# EAGLE design PCU_R0 (EAGLE 7.7.0)
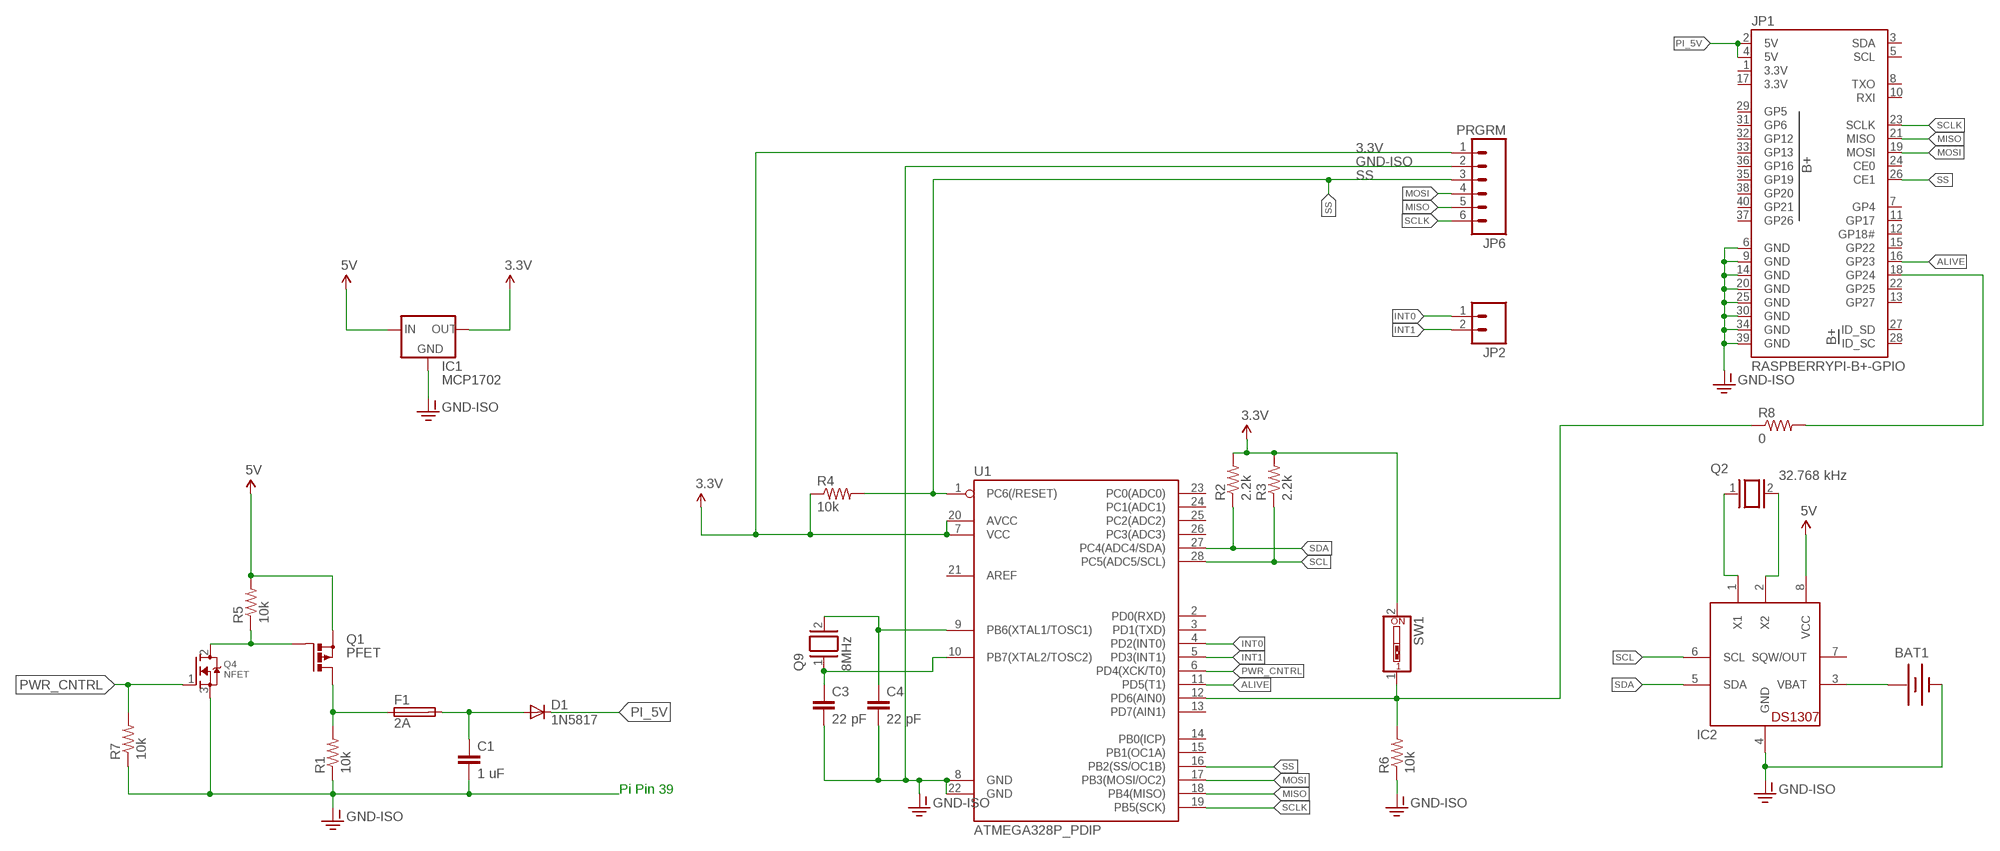
[diagram p0: schematic, sheet 1]

## Parts
BAT1  BATTERY12MM  [BATTCON_12MM]
C1  1 uF  C2,5-3  [C2.5-3]
C3  22 pF  C2,5-3  [C2.5-3]
C4  22 pF  C2,5-3  [C2.5-3]
D1  1N5817  1N4004  [DO41-10]
F1  2A  FUSEPICOFUSE  [PICOFUSE]
IC1  MCP1702  MCP1700TRI  [TO92]
IC2  DS1307  [DIL08]
JP1  RASPBERRYPI-B+-GPIO  [2X20-SHROUDED]
JP2  M02PTH  [1X02]
JP6  PRGRM  M06SILK_FEMALE_PTH  [1X06]
Q1  PFET  PMOSFET_PTO220BV  [TO220BV]
Q2  32.768 kHz  XTAL/S  [QS]
Q4  NFET  MOSFET-NGDS_TO220V  [TO220V]
Q9  8MHz  XTAL/S  [QS]
R1  10k  RESISTOR1206  [1206]
R2  2.2k  RESISTOR1206  [1206]
R3  2.2k  RESISTOR1206  [1206]
R4  10k  RESISTOR1206  [1206]
R5  10k  RESISTOR1206  [1206]
R6  10k  RESISTOR1206  [1206]
R7  10k  RESISTOR1206  [1206]
R8  0  RESISTOR1206  [1206]
SW1  SW_DIP-1  [EDG-01]
U1  ATMEGA328P_PDIP  [DIL28-3]

## Nets
3.3V: IC1.3(OUT) JP6.1 R2.2 R3.2 R4.1 SW1.2 U1.7(VCC) U1.20(AVCC)
5V: IC1.2(IN) IC2.8(VCC) Q1.S R5.2
ALIVE: JP1.16(GP23) U1.11(PD5(T1))
GND-ISO [actuator]: BAT1.GND(-) C1.2 C3.2 C4.2 IC1.1(GND) IC2.4(GND) JP1.6(GND) JP1.9(GND) JP1.14(GND) JP1.20(GND) JP1.25(GND) JP1.30(GND) JP1.34(GND) JP1.39(GND) JP6.2 Q4.3(S) R1.1 R6.1 R7.1 U1.8(GND) U1.22(GND)
INT0: JP2.1 U1.4(PD2(INT0))
INT1: JP2.2 U1.5(PD3(INT1))
MISO: JP1.21(MISO) JP6.5 U1.18(PB4(MISO))
MOSI: JP1.19(MOSI) JP6.4 U1.17(PB3(MOSI/OC2))
N$1: F1.1 Q1.D R1.2
N$2: C1.1 D1.A F1.2
N$3: IC2.1(X1) Q2.1
N$4: IC2.2(X2) Q2.2
N$5: BAT1.PWR@1(+) IC2.3(VBAT)
N$6: Q1.G Q4.2(D) R5.1
N$7 [actuator]: JP1.18(GP24) R8.2
N$8 [actuator]: R6.2 R8.1 SW1.1 U1.12(PD6(AIN0))
N$11: C3.1 Q9.1 U1.10(PB7(XTAL2/TOSC2))
N$20: C4.1 Q9.2 U1.9(PB6(XTAL1/TOSC1))
PI_5V: D1.C JP1.2(5V) JP1.4(5V)
PWR_CNTRL: Q4.1(G) R7.2 U1.6(PD4(XCK/T0))
SCL: IC2.6(SCL) R3.1 U1.28(PC5(ADC5/SCL))
SCLK: JP1.23(SCLK) JP6.6 U1.19(PB5(SCK))
SDA: IC2.5(SDA) R2.1 U1.27(PC4(ADC4/SDA))
SS: JP1.26(CE1) JP6.3 R4.2 U1.1(PC6(/RESET)) U1.16(PB2(SS/OC1B))
Unconnected: IC2.7(SQW/OUT) JP1.3(SDA) JP1.5(SCL) JP1.7(GP4) JP1.8(TXO) JP1.10(RXI) JP1.11(GP17) JP1.12(GP18#) JP1.13(GP27) JP1.15(GP22) JP1.22(GP25) JP1.24(CE0) JP1.27(ID_SD) JP1.28(ID_SC) JP1.29(GP5) JP1.31(GP6) JP1.32(GP12) JP1.33(GP13) JP1.35(GP19) JP1.36(GP16) JP1.37(GP26) JP1.38(GP20) JP1.40(GP21) U1.2(PD0(RXD)) U1.3(PD1(TXD)) U1.13(PD7(AIN1)) U1.14(PB0(ICP)) U1.15(PB1(OC1A)) U1.21(AREF) U1.23(PC0(ADC0)) U1.24(PC1(ADC1)) U1.25(PC2(ADC2)) U1.26(PC3(ADC3))

## Notes on the sheet
- Pi Pin 39

## Power pins joined to a net without a drawn wire
3.3V: JP1.1(3.3V) JP1.17(3.3V)

## Library data of the parts
BAT1 = SparkFun-Electromechanical:BATTERY: Battery Holders Various common sizes : AA, AAA, 18650 (PRT-12895), 20mm coin cell and 12mm coin cell. 20MM_4LEGS, BATT-10373; PROD_ID: BATT-08044
C1 C3 C4 = capacitor-wima:C: CAPACITOR naming: grid - package width
D1 = adafruit:1N4004: DIODE General purpose 1N400x type rectifier (With bigger pads) http://www.ladyada.net/library/pcb/eaglelibrary.html
F1 = fuse:FUSE: Fuse; OC_FARNELL: unknown; OC_NEWARK: unknown
IC1 = adafruit:MCP1700: VOLTAGE REGULATOR
IC2 = adafruit:DS1307: DS1307 Real time clock (RTC) with battery backup ability. Talk to it via i2c
JP1 = SparkFun-Boards:RASPBERRYPI-B+-GPIO: Raspberry Pi B+ GPIO Header 2x20 pin connector
JP2 = SparkFun-Connectors:M02: Standard 2-pin 0.1" header. Use with - straight break away headers ( PRT-00116) - right angle break away headers (PRT-00553) - swiss pins (PRT-00743) - machine pins (PRT-00117) - female headers (PRT-00115) Molex polarized connector foot print use with: PRT-08233 with associated crimp pins and housings. 2.54_SCREWTERM for use with PRT-10571. 3.5mm Screw Terminal footprints for PRT-08084 5mm Screw Terminal footprints for use with PRT-08432
JP6 = SparkFun-Connectors:M06: Header 6 Standard 6-pin 0.1" header. Use with straight break away headers (SKU : PRT-00116), right angle break away headers (PRT-00553), swiss pins (PRT-00743), machine pins (PRT-00117), and female headers (PRT-00115). Molex polarized connector foot print use with SKU : PRT-08094 with associated crimp pins and housings. NOTES ON THE VARIANTS LOCK and LOCK_LONGPADS... This footprint was designed to help hold the alignment of a through-hole component (i.e. 6-pin header) while soldering it into place. You may notice that each hole has been shifted either up or down by 0.005 of an inch from it's more standard position (which is a perfectly straight line). This slight alteration caused the pins (the squares in the middle) to touch the edges of the holes. Because they are alternating, it causes a "brace" to hold the component in place. 0.005 has proven to be the perfect amount of "off-center" position when using our standard breakaway headers. Although looks a little odd when you look at the bare footprint, once you have a header in there, the alteration is very hard to notice. Also,if you push a header all the way into place, it is covered up entirely on the bottom side. This idea of altering the position of holes to aid alignment will be further integrated into the Sparkfun Library for other footprints. It can help hold any component with 3 or more connection pins.; PROD_ID: CONN-08437
Q1 = transistor-power:PMOSFET_P: Power MOSFET P-Channel
Q2 Q9 = special:XTAL/S: CRYSTAL
Q4 = adafruit:MOSFET-N: N-Channel Mosfet 2N7002E - 60V 260mA SOT23 [Digikey: 2N7002ET1GOSTR-ND] - REEL BSH103 - 30V 850mA SOT23 [Digikey: 568-5013-1-ND]
R1-R8 = SparkFun-Passives:RESISTOR: Resistor Basic schematic elements and footprints for 0603, 1206, and PTH resistors.
SW1 = special:SW_DIP-1: DIP SWITCH
U1 = SparkFun-DigitalIC:ATMEGA328P_PDIP: uC used in the Arduino 32kb flash, 1k EEPROM, 2k SRAM This is the through-hole version of this chip.

## Net classes
1 actuator: width 0.813 mm, clearance 0.229 mm
2 motor: width 0.406 mm, clearance 0.229 mm
3 supply: width 0.406 mm, clearance 0.229 mm

## Board
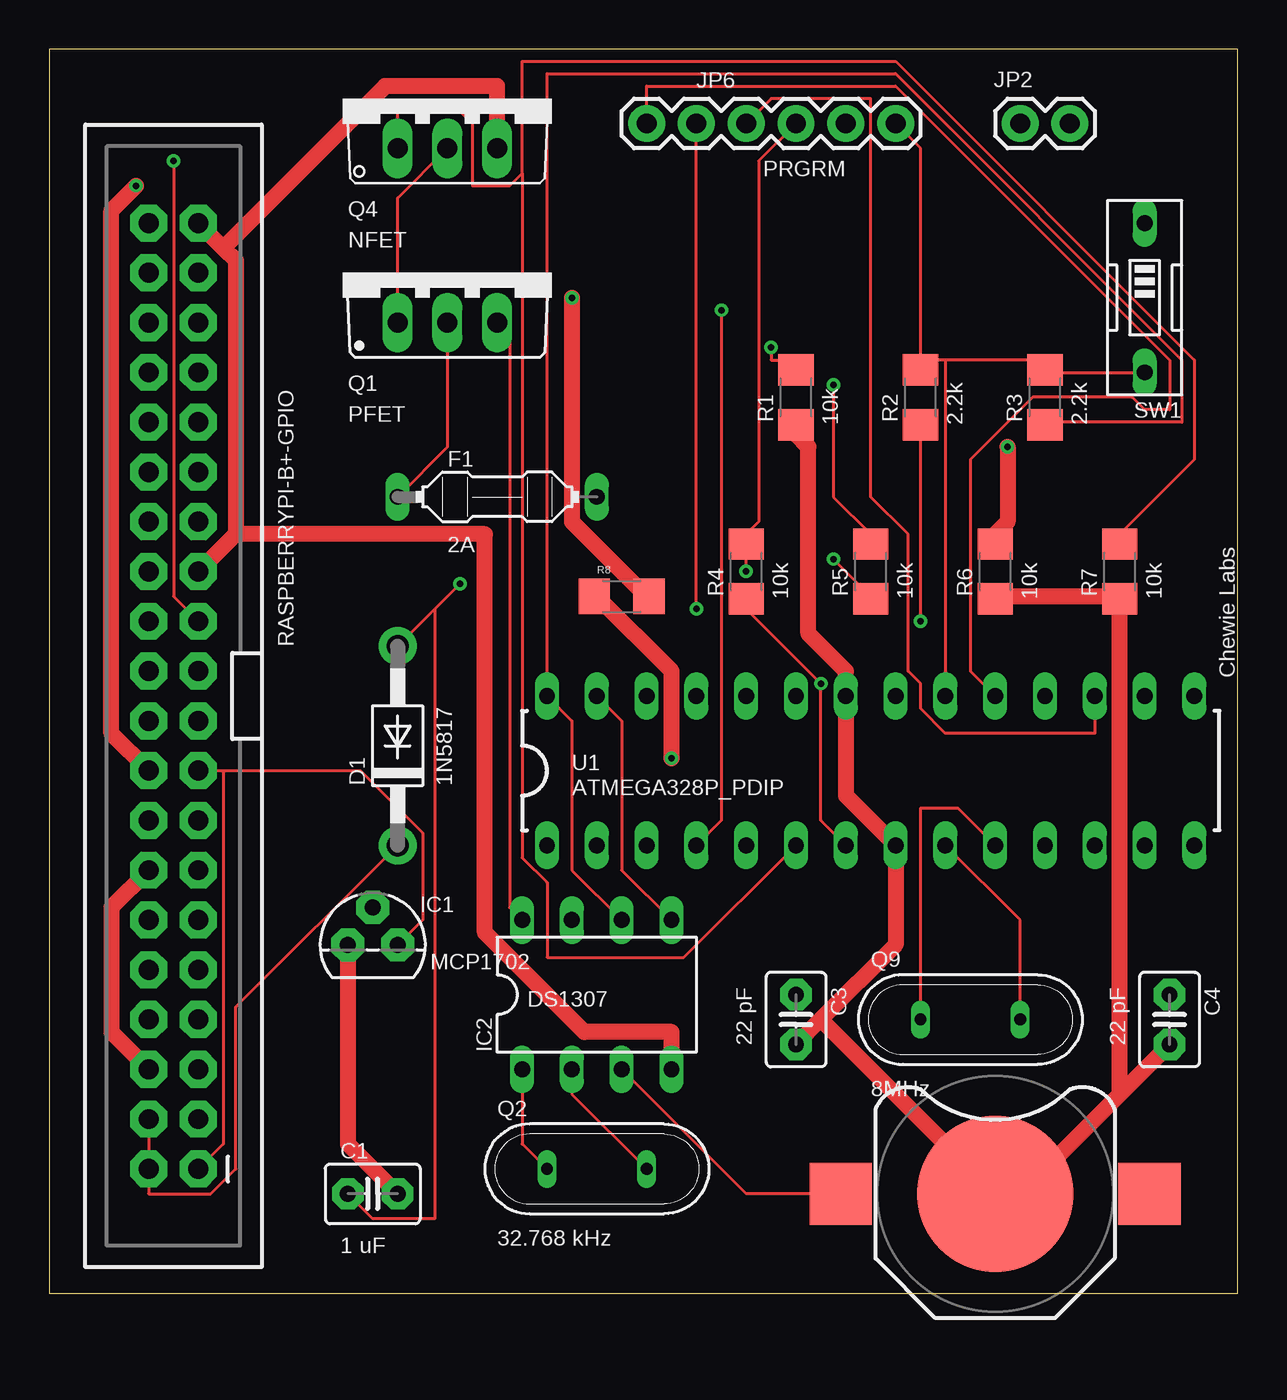
[diagram p1: board, top side]
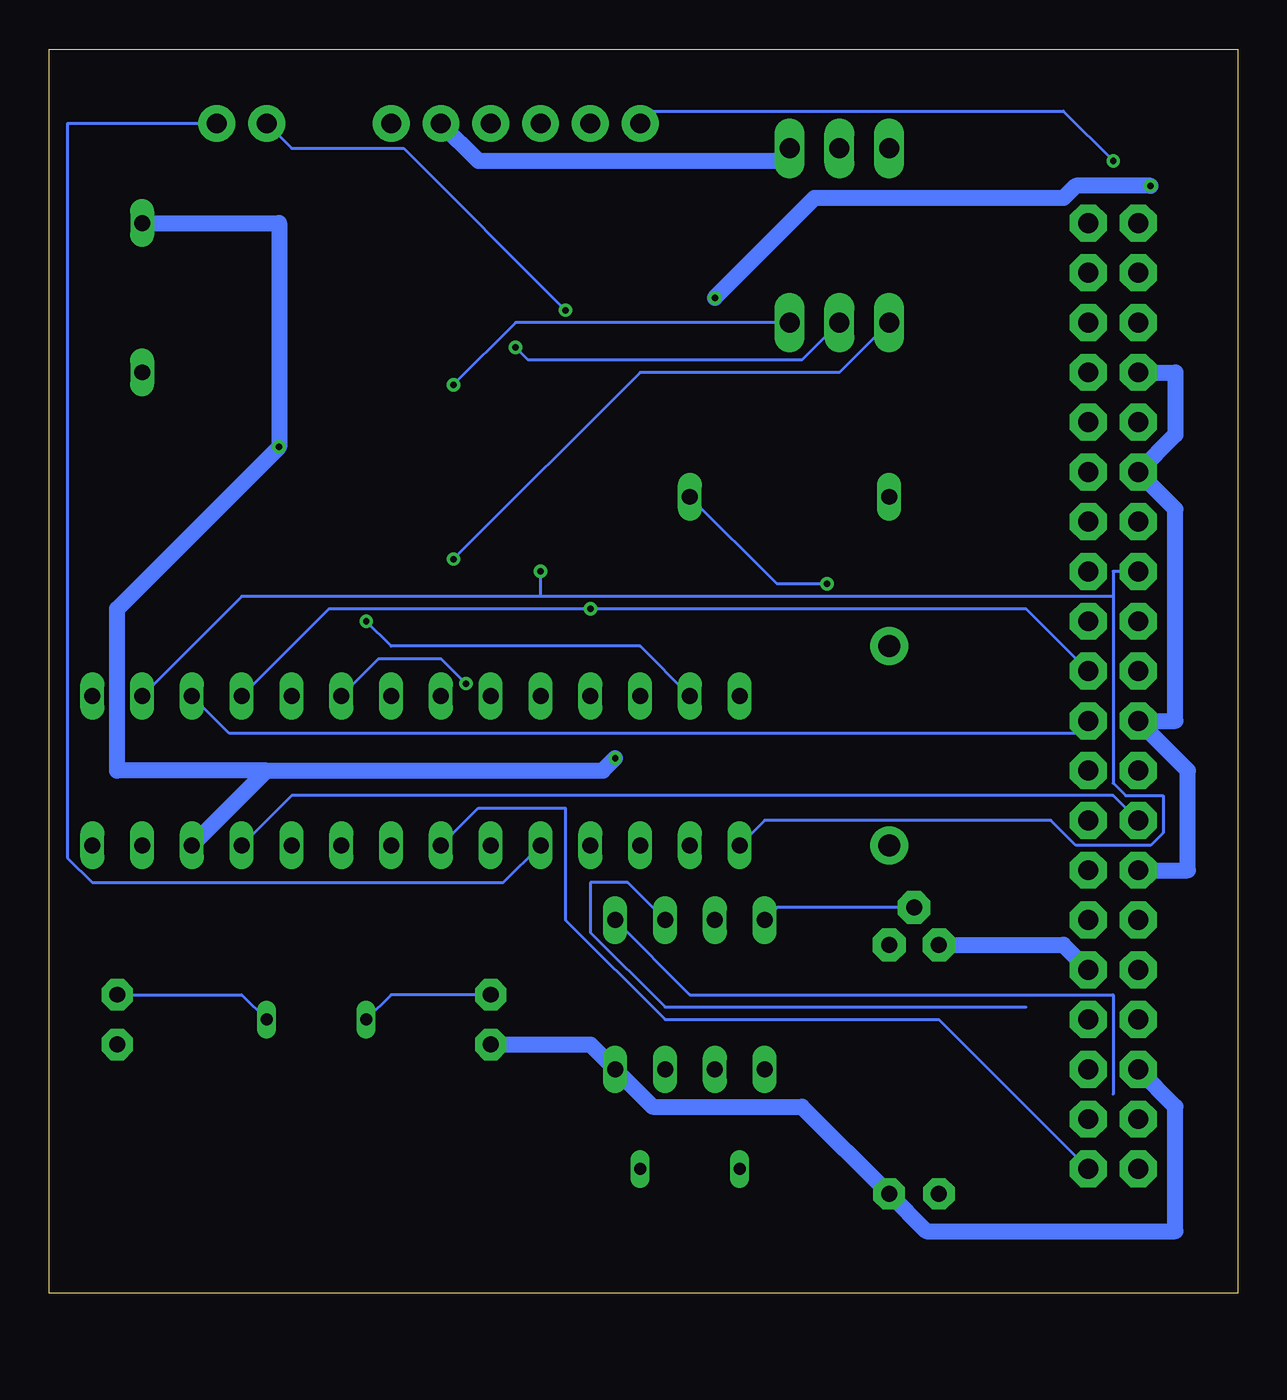
[diagram p2: board, bottom side, seen from below]

Size 60.63 x 63.49 mm. Coordinates in mm from the lower left corner, seen from the top.
Outline: 0,0 60.63,0 60.63,63.49 0,63.49 0,0
Copper layers (1*16): Top 0.0356mm / dielectric 1.5011mm / Bottom 0.0356mm
Design rules "LaenPCBOrder": minimum track width 6mil, minimum drill 13mil, track to track 6mil, track to pad 6mil, pad to pad 6mil, via to via 6mil, smd to smd 6mil, copper to edge 15mil, drill to drill 6mil, minimum pad ring 7mil, minimum via ring 7mil, stop-mask expansion 3mil, vias tented up to drill 0mil, thermal gap 10mil

### Footprints (pad centres in the part's own frame; a part is rotated, then mirrored left to right if it is on the bottom)
BATTCON_12MM = smd 8 x 8: GND 0,0 | smd 3.175 x 3.175: PWR@1 -7.874,0; PWR@2 7.874,0
C2.5-3 = drill 0.813 pad 1.6 octagon: 1 -1.27,0; 2 1.27,0
DO41-10 = drill 1.118 pad 1.93: A 5.08,0; C -5.08,0
PICOFUSE = drill 0.813 long: 1 -5.08,0; 2 5.08,0
TO92 = drill 0.813 pad 1.676 octagon: 1 -1.27,0; 2 0,1.905; 3 1.27,0
DIL08 = drill 0.813 long: 1 -3.81,-3.81; 2 -1.27,-3.81; 3 1.27,-3.81; 4 3.81,-3.81; 5 3.81,3.81; 6 1.27,3.81; 7 -1.27,3.81; 8 -3.81,3.81
2X20-SHROUDED = drill 1.016 pad 1.88 octagon: 1 -1.27,24.13; 2 1.27,24.13; 3 -1.27,21.59; 4 1.27,21.59; 5 -1.27,19.05; 6 1.27,19.05; 7 -1.27,16.51; 8 1.27,16.51; 9 -1.27,13.97; 10 1.27,13.97; 11 -1.27,11.43; 12 1.27,11.43; 13 -1.27,8.89; 14 1.27,8.89; 15 -1.27,6.35; 16 1.27,6.35; 17 -1.27,3.81; 18 1.27,3.81; 19 -1.27,1.27; 20 1.27,1.27; 21 -1.27,-1.27; 22 1.27,-1.27; 23 -1.27,-3.81; 24 1.27,-3.81; 25 -1.27,-6.35; 26 1.27,-6.35; 27 -1.27,-8.89; 28 1.27,-8.89; 29 -1.27,-11.43; 30 1.27,-11.43; 31 -1.27,-13.97; 32 1.27,-13.97; 33 -1.27,-16.51; 34 1.27,-16.51; 35 -1.27,-19.05; 36 1.27,-19.05; 37 -1.27,-21.59; 38 1.27,-21.59; 39 -1.27,-24.13; 40 1.27,-24.13
1X02 = drill 1.016 pad 1.88: 1 0,0; 2 2.54,0
1X06 = drill 1.016 pad 1.88: 1 0,0; 2 2.54,0; 3 5.08,0; 4 7.62,0; 5 10.16,0; 6 12.7,0
TO220BV = drill 1.016 long: D 0,-2.54; G -2.54,-2.54; S 2.54,-2.54
QS = drill 0.61 long: 1 -2.54,0; 2 2.54,0
TO220V = drill 1.016 long: 1 -2.54,-2.54; 2 0,-2.54; 3 2.54,-2.54
1206 = smd 1.6 x 1.8: 1 -1.4,0; 2 1.4,0
EDG-01 = drill 0.813 long: 1 0,-3.81; 2 0,3.81
DIL28-3 = drill 0.813 long: 1 -16.51,-3.81; 2 -13.97,-3.81; 3 -11.43,-3.81; 4 -8.89,-3.81; 5 -6.35,-3.81; 6 -3.81,-3.81; 7 -1.27,-3.81; 8 1.27,-3.81; 9 3.81,-3.81; 10 6.35,-3.81; 11 8.89,-3.81; 12 11.43,-3.81; 13 13.97,-3.81; 14 16.51,-3.81; 15 16.51,3.81; 16 13.97,3.81; 17 11.43,3.81; 18 8.89,3.81; 19 6.35,3.81; 20 3.81,3.81; 21 1.27,3.81; 22 -1.27,3.81; 23 -3.81,3.81; 24 -6.35,3.81; 25 -8.89,3.81; 26 -11.43,3.81; 27 -13.97,3.81; 28 -16.51,3.81

### Placement (x,y rotation side)
BAT1  48.26,5.08 0 top
C1  16.51,5.08 0 top
C3  38.1,13.97 270 top
C4  57.15,13.97 270 top
D1  17.78,27.94 90 top
F1  22.86,40.64 0 top
IC1  16.51,17.78 0 top
IC2  27.94,15.24 0 top
JP1  6.35,30.48 180 top
JP2  49.53,59.69 0 top
JP6  43.18,59.69 180 top
Q1  20.32,52.07 0 top
Q2  27.94,6.35 0 top
Q4  20.32,60.96 0 top
Q9  46.99,13.97 0 top
R1  38.1,45.72 90 top
R2  44.45,45.72 90 top
R3  50.8,45.72 90 top
R4  35.56,36.83 90 top
R5  41.91,36.83 90 top
R6  48.26,36.83 90 top
R7  54.61,36.83 90 top
R8  29.21,35.56 0 top
SW1  55.88,50.8 180 top
U1  41.91,26.67 0 top

### Tracks (layer width: path | path; a pad name or v marks a point on that pad's centre or on a via)
3.3V  (via drill 0.33)
  Top 0.152: IC1.3 19.05,19.05 19.05,23.5 15.88,26.67 8.89,26.67 | JP1.17 8.89,26.67 | JP1.1 8.89,7.62 8.89,26.67 | U1.7 39.37,24.13 v39.37,31.11 35.56,34.93 R4.1 | 45.72,47.62 50.8,47.62 R3.2 50.8,46.99 SW1.2 | 45.72,47.62 44.45,47.62 | 45.72,47.62 U1.20 | JP6.1 44.45,58.42 44.45,47.62 | 44.45,47.62 R2.2
  Bottom 0.152: v39.37,31.11 40.64,32.38 43.81,32.38 U1.20 | JP1.1 15.24,13.97 29.21,13.97 34.29,19.05 34.29,24.77 38.73,24.77 U1.7
5V  (via drill 0.33)
  Top 0.152: v40,46.36 40,40.64 41.91,38.74 R5.2 | IC2.8 23.5,19.68 23.5,48.9 Q1.S
  Bottom 0.152: IC2.8 23.5,19.68 IC1.2 | v40,46.36 36.83,49.53 Q1.S
ALIVE
  Bottom 0.152: U1.11 48.26,25.4 6.35,25.4 JP1.16
GND-ISO
  Top 0.813: 9.52,38.74 JP1.25 | 9.52,38.74 9.52,52.71 8.89,53.34 | JP1.39 8.89,53.34 | 8.89,53.34 17.14,61.6 22.86,61.6 Q4.3 | R6.1 48.26,35.56 54.61,35.56 R7.1 54.61,10.16 | 54.61,10.16 49.53,5.08 BAT1.GND 39.37,13.97 | 54.61,10.16 C4.2 | JP1.6 3.18,13.33 3.18,19.68 JP1.14 | C1.2 15.24,7.62 IC1.1 | R1.1 38.1,43.82 38.73,43.18 38.73,33.66 40.64,31.75 U1.22 40.64,25.4 U1.8 43.18,17.78 39.37,13.97 | 39.37,13.97 C3.2 | 9.52,38.74 22.22,38.74 22.22,18.41 27.31,13.33 31.75,13.33 IC2.4
  Bottom 0.813: Q4.3 23.5,57.79 38.73,57.79 JP6.2 | JP1.34 3.18,46.99 3.18,43.82 JP1.30 3.18,40.01 3.18,29.21 JP1.20 2.54,26.67 2.54,21.59 JP1.14 | JP1.9 8.89,17.78 IC1.1 | C3.2 33.02,12.7 IC2.4 29.85,9.53 22.22,9.53 C1.2 15.88,3.17 3.18,3.17 3.18,9.53 JP1.6
INT0  (via drill 0.33)
  Top 0.152: U1.4 34.29,24.13 v34.29,50.17
  Bottom 0.152: v34.29,50.17 42.55,58.42 48.26,58.42 JP2.1
INT1
  Bottom 0.152: U1.5 37.47,20.95 58.42,20.95 59.69,22.22 59.69,59.69 JP2.2
MISO  (via drill 0.33)
  Top 0.152: v33.02,34.93 JP6.5
  Bottom 0.152: U1.18 46.36,34.93 v33.02,34.93 10.79,34.93 JP1.21
MOSI
  Top 0.152: JP6.4 36.83,60.96 41.91,60.96 41.91,40.64 43.81,38.74 43.81,31.75 44.45,31.11 44.45,29.84 45.72,28.57 53.34,28.57 U1.17
  Bottom 0.152: U1.17 51.44,28.57 8.25,28.57 JP1.19
N$1  (via drill 0.33)
  Top 0.152: v36.83,48.26 36.83,47.62 38.1,47.62 R1.2 | F1.1 20.32,43.18 Q1.D
  Bottom 0.152: v36.83,48.26 36.19,47.62 22.22,47.62 Q1.D
N$2  (via drill 0.33)
  Top 0.152: D1.A 19.68,34.93 | 19.68,34.93 v20.95,36.2 | C1.1 16.51,3.81 19.68,3.81 19.68,34.93
  Bottom 0.152: F1.2 23.5,36.2 v20.95,36.2
N$3
  Top 0.152: Q2.1 24.13,7.62 IC2.1
N$4
  Top 0.152: Q2.2 26.67,10.16 IC2.2
N$5
  Top 0.152: IC2.3 35.56,5.08 BAT1.PWR@1
N$6  (via drill 0.33)
  Top 0.152: v40,37.47 41.91,35.56 R5.1 | Q4.2 17.78,55.88 Q1.G
  Bottom 0.152: v40,37.47 30.48,46.99 20.32,46.99 Q1.G
N$7  (via drill 0.33)
  Top 0.813: v26.67,50.8 26.67,39.37 30.48,35.56 R8.2 | v4.45,56.52 3.18,55.25 3.18,28.57 JP1.18
  Bottom 0.813: v26.67,50.8 21.59,55.88 8.89,55.88 8.25,56.52 v4.45,56.52
N$8  (via drill 0.33)
  Top 0.813: v48.89,43.18 48.89,39.37 48.26,38.74 R6.2 | v31.75,27.3 31.75,31.75 27.94,35.56 R8.1
  Bottom 0.813: SW1.1 48.89,54.61 v48.89,43.18 57.15,34.93 57.15,26.67 49.53,26.67 | v31.75,27.3 32.39,26.67 49.53,26.67 | U1.12 49.53,26.67
N$11
  Top 0.152: U1.10 46.36,24.77 44.45,24.77 Q9.1
  Bottom 0.152: Q9.1 43.18,15.24 C3.1
N$20
  Top 0.152: U1.9 49.53,19.05 Q9.2
  Bottom 0.152: Q9.2 50.8,15.24 C4.1
PI_5V
  Top 0.152: JP1.4 JP1.2 5.08,5.08 8.25,5.08 9.52,6.35 9.52,14.61 D1.C
PWR_CNTRL
  Top 0.152: 24.13,57.15 24.13,62.87 43.18,62.87 58.42,47.62 58.42,42.55 54.61,38.74 R7.2 | 24.13,57.15 23.5,56.52 21.59,56.52 21.59,59.69 20.95,60.33 17.78,60.33 Q4.1 | U1.6 32.39,17.14 25.4,17.14 25.4,20.95 24.13,22.22 24.13,57.15
SCL
  Top 0.152: R3.1 50.8,44.45 57.78,44.45 57.78,47.62 43.18,62.23 25.4,62.23 U1.28 26.67,29.21 26.67,21.59 IC2.6
  Bottom 0.152: 10.79,14.61 29.21,14.61 33.02,18.41 33.02,20.95 31.11,20.95 IC2.6
SCLK  (via drill 0.33)
  Top 0.152: U1.19 46.99,31.75 46.99,42.55 50.17,45.72 55.25,45.72 55.88,45.09 57.15,45.09 57.15,47.62 43.18,61.6 30.48,61.6 JP6.6 | JP1.23 6.35,35.56 v6.35,57.79
  Bottom 0.152: v6.35,57.79 8.89,60.33 29.85,60.33 JP6.6
SDA  (via drill 0.33)
  Top 0.152: v44.45,34.29 R2.1 | IC2.5 29.21,21.59 29.21,29.21 U1.27
  Bottom 0.152: v44.45,34.29 43.18,33.02 30.48,33.02 U1.27 | 6.35,10.16 6.35,15.24 27.94,15.24 IC2.5
SS  (via drill 0.33)
  Top 0.152: JP6.3 36.19,57.79 36.19,39.37 35.56,38.74 R4.2 v35.56,36.83
  Bottom 0.152: U1.1 24.13,24.13 9.52,24.13 8.25,22.86 4.45,22.86 3.81,23.5 3.81,25.4 5.71,25.4 6.35,26.04 6.35,35.56 | 6.35,35.56 6.35,36.83 JP1.26 | U1.16 50.8,35.56 35.56,35.56 | 6.35,35.56 35.56,35.56 | 35.56,35.56 v35.56,36.83

### Text on the board
tPlace: Chewie Labs